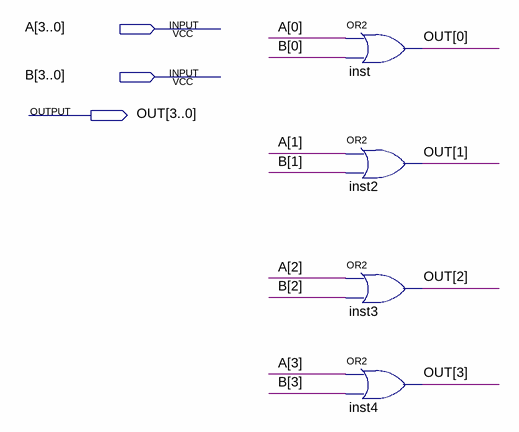
[diagram p0: schematic sheet]
// Quartus schematic OR_4BITS.bdf as structural Verilog: 4 symbols, 3 pins
module OR_4BITS (
  input  [3:0] A,
  input  [3:0] B,
  output [3:0] OUT
);

  or inst (OUT[0], A[0], B[0]);
  or inst2 (OUT[1], A[1], B[1]);
  or inst3 (OUT[2], A[2], B[2]);
  or inst4 (OUT[3], A[3], B[3]);
endmodule
